# EAGLE design RTK_mosaic-X5_Front_Panel (EAGLE 9.6.2)
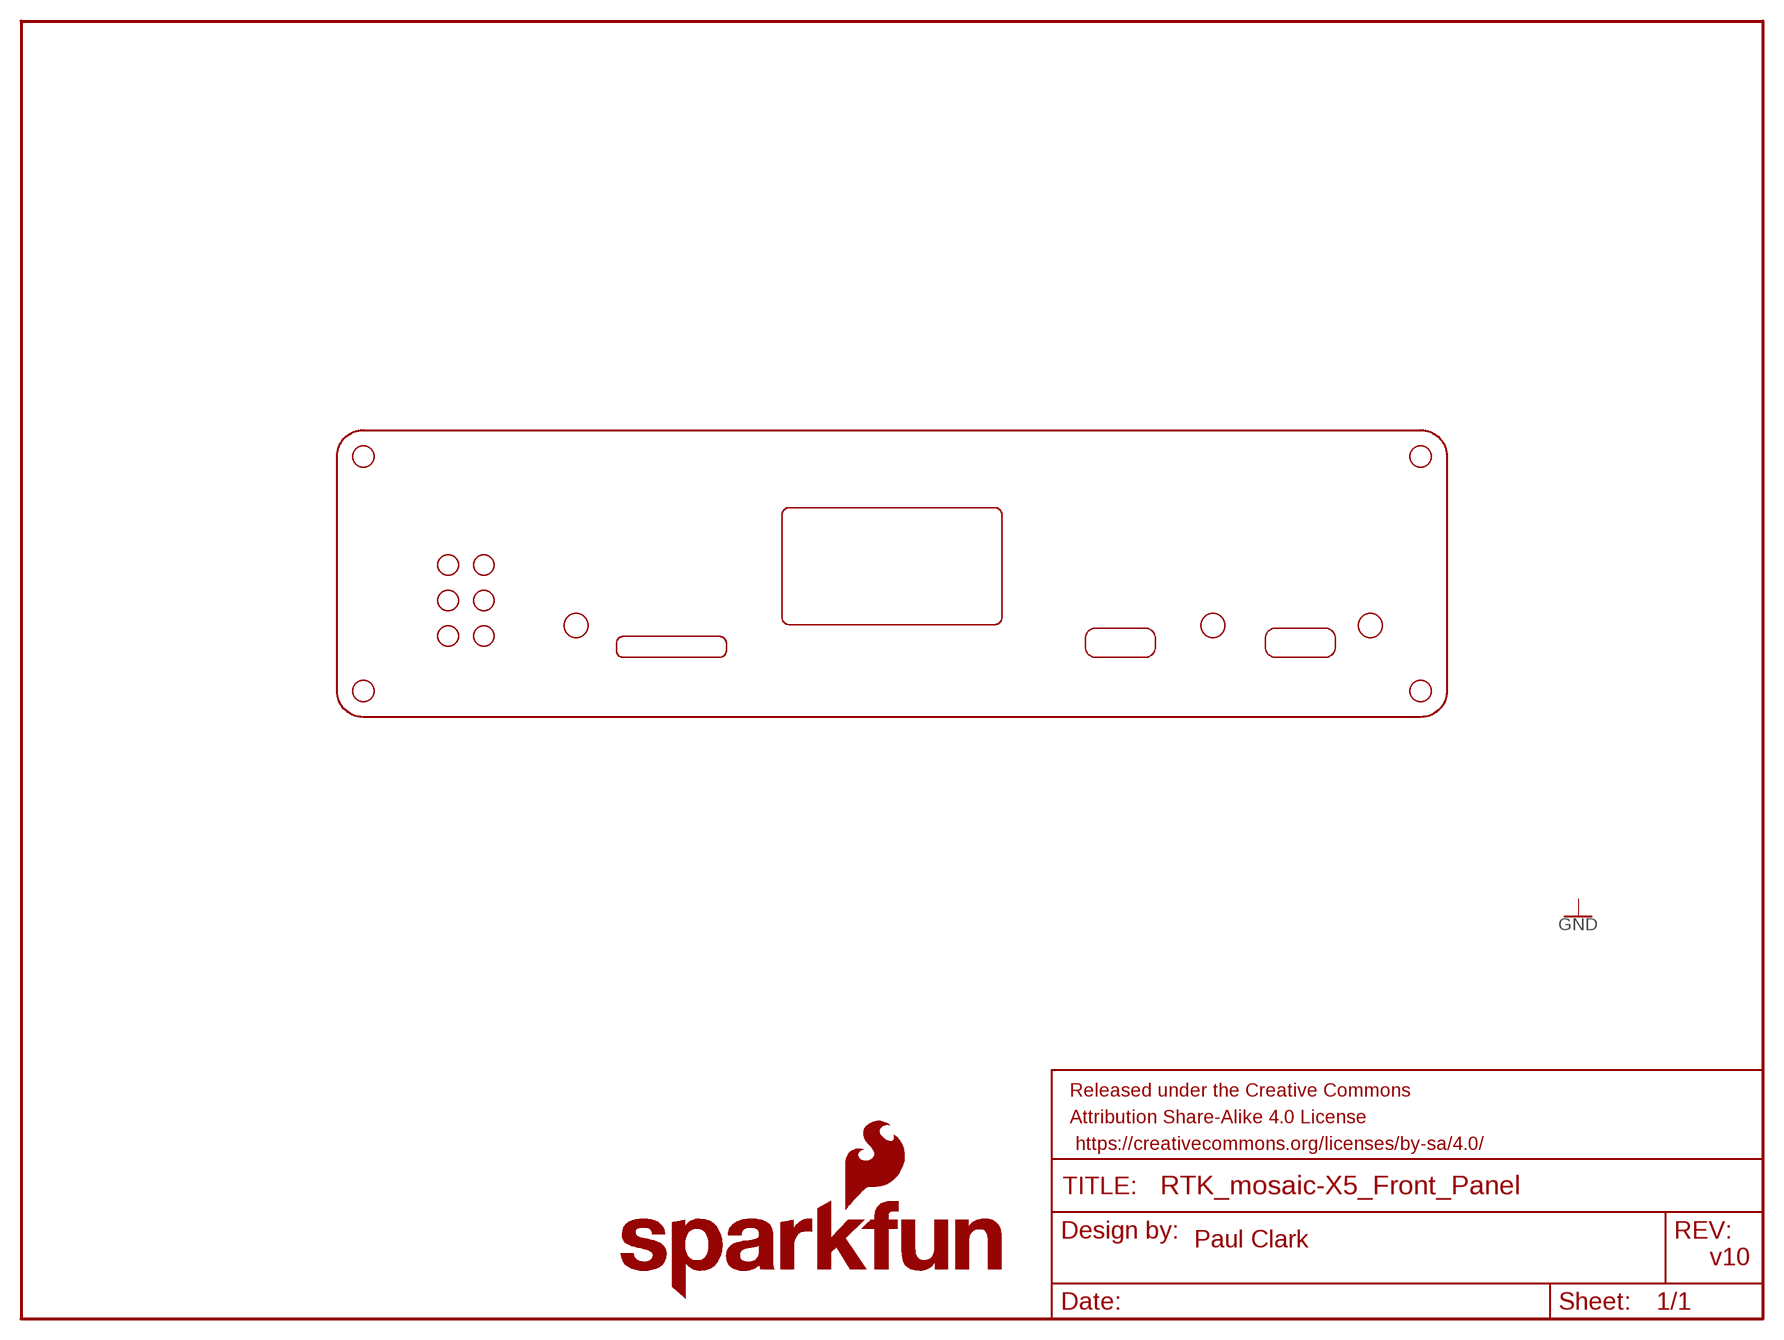
[diagram p0: schematic, sheet 1]

## Parts
BOOT  BUTTON_SWCH-13896  [BUTTON]
ESP32_USB  USB-C_CONN-14122  [USB-C]
FRAME1  FRAME-LETTER  [CREATIVE_COMMONS]
GNSS_USB  USB-C_CONN-14122  [USB-C]
LOGO1  SFE_LOGO_NAME_FLAME.3_INCH  [SFE_LOGO_NAME_FLAME_.3]
MICRO_SD  MICRO_SD_CONN-16110  [MICRO_SD]
OLED  OLED_1.3_128X64  [OLED-1.3-128X64]
PANEL_OUTLINE  PANEL_OUTLINE  [PANEL_OUTLINE]
RESET  BUTTON_SWCH-13896  [BUTTON]
RESET1  BUTTON_SWCH-13896  [BUTTON]
U$5  CBI_LED_TRIPLE-3MM_DIO-19990  [CBI_LED_TRIPLE-3MM]
U$16  CBI_LED_TRIPLE-3MM_DIO-19990  [CBI_LED_TRIPLE-3MM]

## Notes on the sheet
- Paul Clark
- v10

## Library data of the parts
BOOT RESET RESET1 = SparkFun-Enclosure-Panel:BUTTON_SWCH-13896: This is the enclosure panel cut-out for the momentary switch (MOMENTARY-SWITCH-SPST-PTH-RIGHT-ANGLE-8-020, SWCH-13896)
ESP32_USB GNSS_USB = SparkFun-Enclosure-Panel:USB-C_CONN-14122: This is the enclosure panel cut-out for the USB-C socket <https://www.sparkfun.com/products/15111> (CONN-14122)
FRAME1 = SparkFun-Aesthetics:FRAME-LETTER: Schematic Frame - Letter Standard 8.5x11 US Letter frame
LOGO1 = SparkFun-Aesthetics:SFE_LOGO_NAME_FLAME: SparkFun Font Logo w/ Flame This is the SparkFun full logo. The logo on the schematic will always be the same size; the package variant is the height of the flame part of the logo. Default layer for the logo on the board is tSilk.
MICRO_SD = SparkFun-Enclosure-Panel:MICRO_SD_CONN-16110: This is the enclosure panel cut-out for the microSD socket (push-push) (MICRO-SD-PUSH-PUSH-EXT-PIN, CONN-16110)
OLED = SparkFun-Enclosure-Panel:OLED_1.3_128X64: This is the enclosure panel cut-out for the new 1.3" 128x64 OLED display.
PANEL_OUTLINE = SparkFun-Enclosure-Panel:PANEL_OUTLINE: Panel Outline This is the outline of the front and rear panels for the SparkFun Metal Enclosure - Custom Aluminum Extrusion (6x4in. PCB) <https://www.sparkfun.com/products/22640> The origin is centered on the top surface of the PCB
U$5 U$16 = SparkFun-Enclosure-Panel:CBI_LED_TRIPLE-3MM_DIO-19990: This is the enclosure panel cut-out for the right angle PTH triple-3mm CBI LED (E.g.: Yellow-Green-Red DIO-19990)

## Board
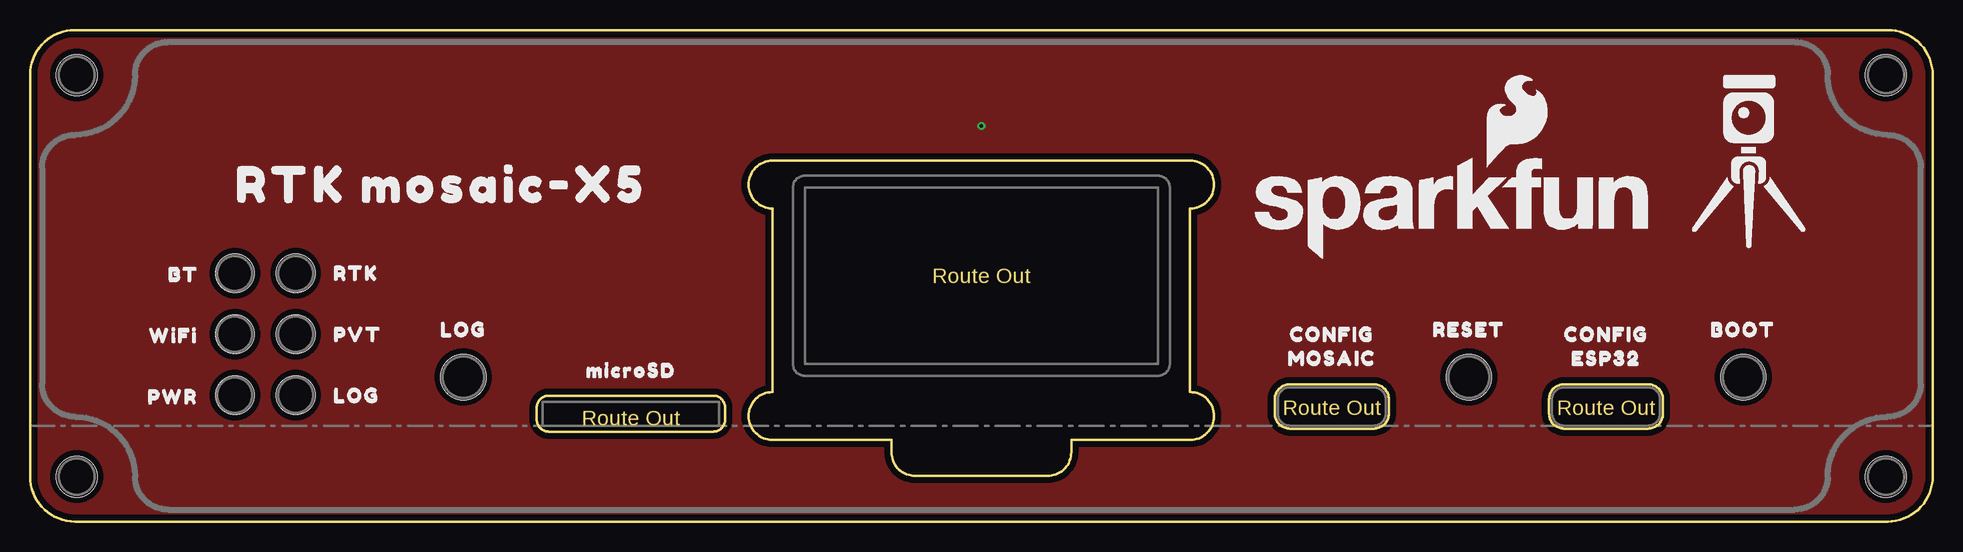
[diagram p1: board, top side]
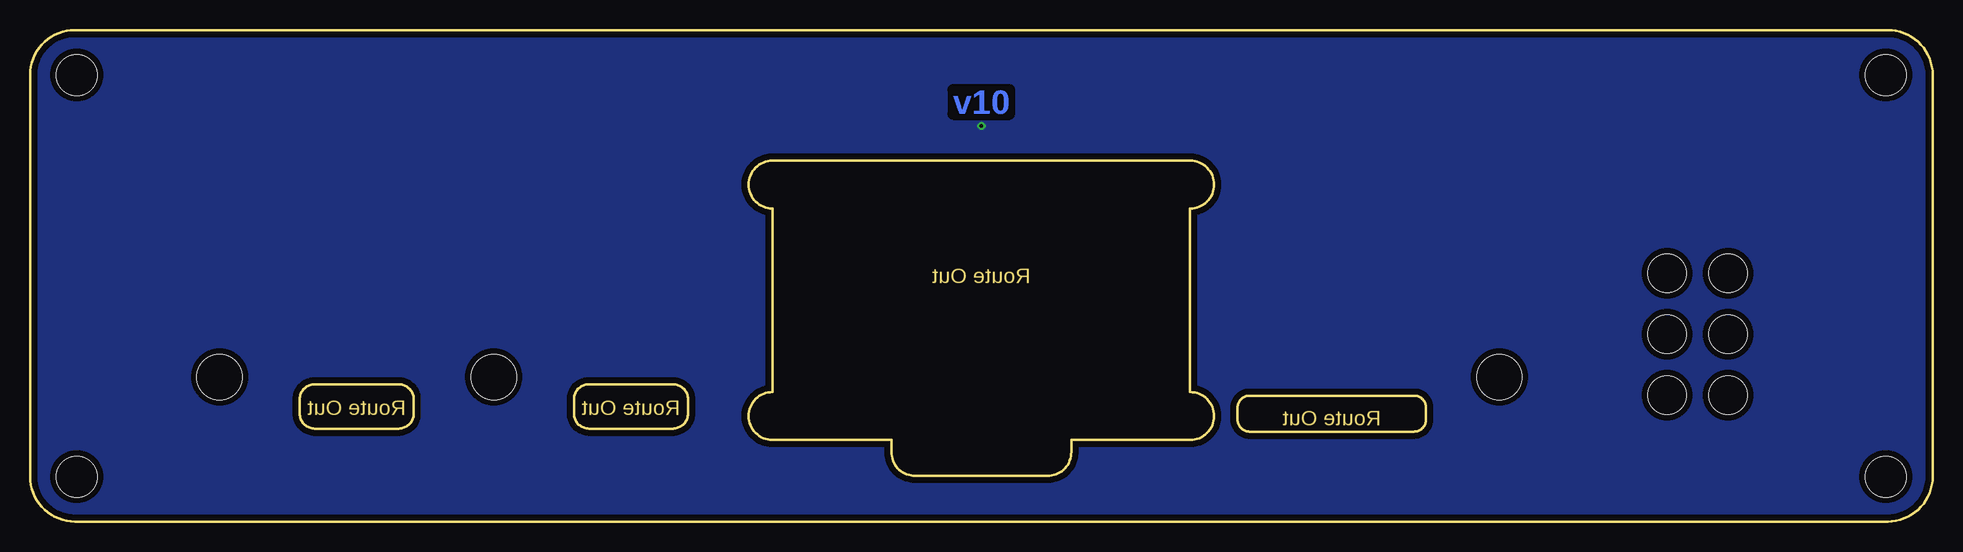
[diagram p2: board, bottom side, seen from below]

Size 158.6 x 41 mm. Coordinates in mm from the lower left corner, seen from the top.
Outline: 0,3.75 arc90 3.75,0 154.85,0 arc90 158.6,3.75 158.6,37.25 arc90 154.85,41 3.75,41 arc90 0,37.25 0,3.75
Copper layers (1*16): Top 0.035mm / dielectric 1.5mm / Bottom 0.035mm
Design rules "SparkFun-2-Layer-General-JLCPCB": minimum track width 7mil, minimum drill 0.3mm, track to track 7mil, track to pad 7mil, pad to pad 7mil, via to via 7mil, smd to smd 7mil, copper to edge 7mil, drill to drill 7mil, minimum pad ring 7mil, minimum via ring 7mil, stop-mask expansion 3mil, vias tented up to drill 25mil, thermal gap 10mil

### Footprints (pad centres in the part's own frame; a part is rotated, then mirrored left to right if it is on the bottom)
BUTTON = hole 3.75: 0,4.05
PANEL_OUTLINE = hole 3.4: -75.4,29.25; 75.4,29.25; 75.4,-4.25; -75.4,-4.25
CBI_LED_TRIPLE-3MM = hole 3.2: 0,2.54; 0,7.62; 0,12.7

### Placement (x,y rotation side)
BOOT  142.8,8 0 top
ESP32_USB  108.51,8 0 top
FRAME1  60.25,-16.13 0 top  (outside the outline)
GNSS_USB  131.37,8 0 top
LOGO1  118.45,26.09 0 top
MICRO_SD  50.09,8 0 top
OLED  79.3,20.5 0 top
PANEL_OUTLINE  79.3,8 0 top
RESET  119.94,8 0 top
RESET1  36.12,8 0 top
U$1  [MOSAIC5]  108.51,13.6 0 top
U$3  [BT0]  12.8,20.6 0 top
U$4  [LOG6]  36.12,16 0 top
U$5  22.15,8 0 top
U$6  [LOG6]  27.21,10.5 0 top
U$7  [MICROSD1]  50.09,12.6 0 top
U$8  [RESET2]  119.94,16 0 top
U$9  [CONFIG3]  108.51,15.6 0 top
U$10  [CONFIG3]  131.37,15.6 0 top
U$11  [ESP324]  131.37,13.6 0 top
U$12  [WIFI1]  11.95,15.5 0 top
U$13  [PVT2]  27.3,15.6 0 top
U$14  [RTK3]  27.16,20.7 0 top
U$15  [RTK_MOSAIC#X50]  34.3,28.09 0 top
U$16  17.07,8 0 top
U$17  [PWR0]  11.9,10.4 0 top
U$18  [BOOT0]  142.8,16 0 top

### Tracks (layer width: path | path; a pad name or v marks a point on that pad's centre or on a via)
GND  (via drill 0.3)
  other vias: 79.3,33
  pour Top (isolate 0.5, no thermals): 0,41 158.6,41 158.6,0 0,0
  pour Bottom (isolate 0.5, no thermals): 0,41 158.6,41 158.6,0 0,0

### Text on the board
Bottom: v10
tDocu: Paul Clark